# Altium schematic sheet PowerMCU.SchDoc: Title
size A4; Date: *******; ApprovedBy: *******; CheckedBy: Yasiru; Author: *******; CompanyName: *******; DrawnBy: Name; Engineer: *******; Organization: *******; Address1: *******; Address2: *******; Address3: *******; Address4: *******; DocumentNumber: Doc Num; Revision: *******; SheetNumber: 5; SheetTotal: 11; Subtitle: Power Supply for MCU; Project: Resturant Robot; VersionRevision: III; TotalSheet: 11; CurrentTime: *******; CurrentDate: *******; Time: *******; DocumentFullPathAndName: *******; DocumentName: *******; ModifiedDate: *******; ImagePath: *******; ProjectName: *******; Application_BuildNumber: *******
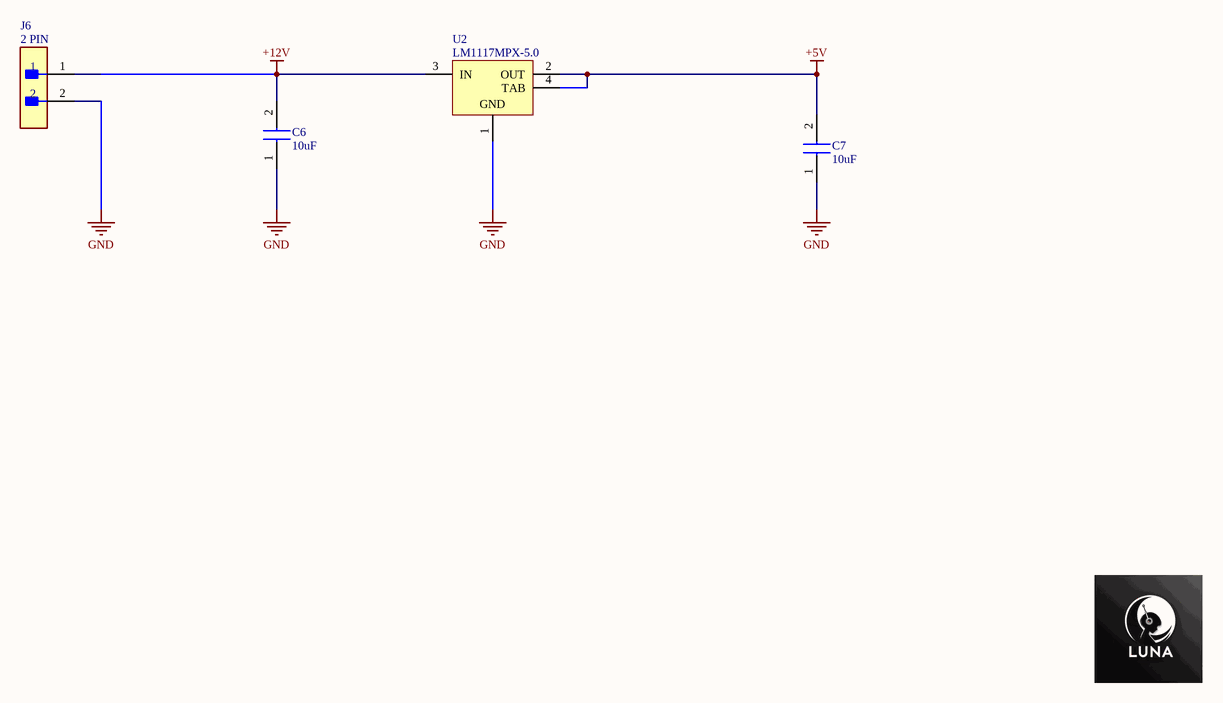
[diagram p0: PowerMCU.SchDoc]

## Parts
C6  10uF  [CAPC1608X90N]
C7  10uF  [CAPC1608X90N]
J6  2 PIN  [FP-B2B-XH-AM_LF_SN-MFG]
U2  LM1117MPX-5.0  [DCY0004A_L]

## Nets
+5V: C7.2 U2.2(OUT) U2.4(TAB)
+12V: C6.2 J6.1 U2.3(IN)
GND: C6.1 C7.1 J6.2 U2.1(GND)

## Notes on the sheet
- Title:
- Drawn By:
- Page Contents:
- Checked By:
- Subtitle:
- University Of Moratuwa
- Moratuwa
- Size:
- Date:
- File:
- Email:
- A4
- lasithnawanjaan123@gmail.com
- Lasith Haputhanthri
- Number:
- Time:
- Revision:
- Sheet
- of
- Katubedda
- 10500
- Sri Lanka

## Library data of the parts
C6 C7 = CL10A106KP8NNNC: CL10A106KP8NNNC Capacitor; Manufacturer_Name: SAMSUNG; Datasheet Link: https://datasheet.datasheetarchive.com/originals/distributors/Datasheets-DGA10/2415998.pdf; Height: 0.9mm; Manufacturer_Part_Number: CL10A106KP8NNNC; Mouser Part Number: 187-CL10A106KP8NNNC; Mouser Price/Stock: https://www.mouser.co.uk/ProductDetail/Samsung-Electro-Mechanics/CL10A106KP8NNNC?qs=X6jEic%2FHinAlyfRHj7fKwg%3D%3D; Arrow Part Number: CL10A106KP8NNNC; Arrow Price/Stock: https://www.arrow.com/en/products/cl10a106kp8nnnc/samsung-electro-mechanics?region=europe
J6 = CMP-17439-000037-1: CONN HEADER VERT 2POS 2.5MM; Max Voltage Rating (AC): 250V; Connector Type: Male Pin; Contact Resistance: 20mR; Max Current Rating: 3A; Number of Positions: 2; Series: XH; Contact Material: Brass; Mount: Through Hole; Housing Material: Polyamide; Contact Plating: Tin; Termination: Solder; Max Operating Temperature: 85°C; Depth: 5.75mm; Packaging: Bulk; Min Operating Temperature: -25°C; Contact Type: Male Pin; Color: Green; Pitch: 2.5mm; Length: 7.4mm; Lead Free: Lead Free; Number of Rows: 1; Fastening Type: Detent; Housing Color: White; Orientation: Straight
U2 = CMP-0062-01637-4: 800mA Low-Dropout Linear Regulator, 4-pin SOT-223; Manufacturer: Texas Instruments; High-Reliability: Y; PowerWise: N; PackageTopMarking: XYTT*N06A; CompType: LDO IC; PackageDescription: Molded SOT-223, 6.50 x 3.56 x 1.6mm Body, 4 Lead, 2.3mm Pitch; PackageReference: DCY0004A; ComponentLink1URL: http://www.ti.com/general/docs/lit/getliterature.tsp?genericPartNumber=LM1117-N&fileType=pdf; Code_JEDEC: TO-261-AA; ComponentLink1Description: Datasheet URL; PartNumber: LM1117MPX-5.0; Code_IPC: SOT223-4; RoHS: N; PinCount: 4